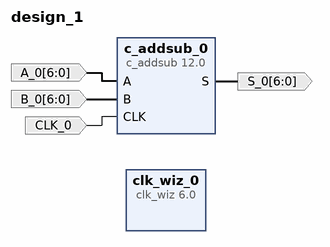
[diagram p0: block diagram of the top level]
# Vivado block design design_1, xc7a100tcsg324-1, Vivado 2019.2
create_bd_design design_1

create_bd_port -dir I -from 6 -to 0 -type data A_0
create_bd_port -dir I -from 6 -to 0 -type data B_0
create_bd_port -dir I -type clk CLK_0
create_bd_port -dir O -from 6 -to 0 -type data S_0

create_bd_cell -type ip -vlnv xilinx.com:ip:c_addsub:12.0 c_addsub_0
set_property -dict [list \
  CONFIG.A_Type Signed \
  CONFIG.A_Width 7 \
  CONFIG.B_Type Signed \
  CONFIG.B_Value 0000000 \
  CONFIG.B_Width 7 \
  CONFIG.CE false \
  CONFIG.Latency 1 \
  CONFIG.Out_Width 7 \
] [get_bd_cells c_addsub_0]
create_bd_cell -type ip -vlnv xilinx.com:ip:clk_wiz:6.0 clk_wiz_0

# ---- connections ----

connect_bd_net -net A_0_1 [get_bd_ports A_0] [get_bd_pins c_addsub_0/A]
connect_bd_net -net B_0_1 [get_bd_ports B_0] [get_bd_pins c_addsub_0/B]
connect_bd_net -net CLK_0_1 [get_bd_ports CLK_0] [get_bd_pins c_addsub_0/CLK]
connect_bd_net [get_bd_pins c_addsub_0/S] [get_bd_ports S_0]

validate_bd_design
save_bd_design
